# EAGLE schematic sdcard_noBMP (EAGLE 9.6.0)
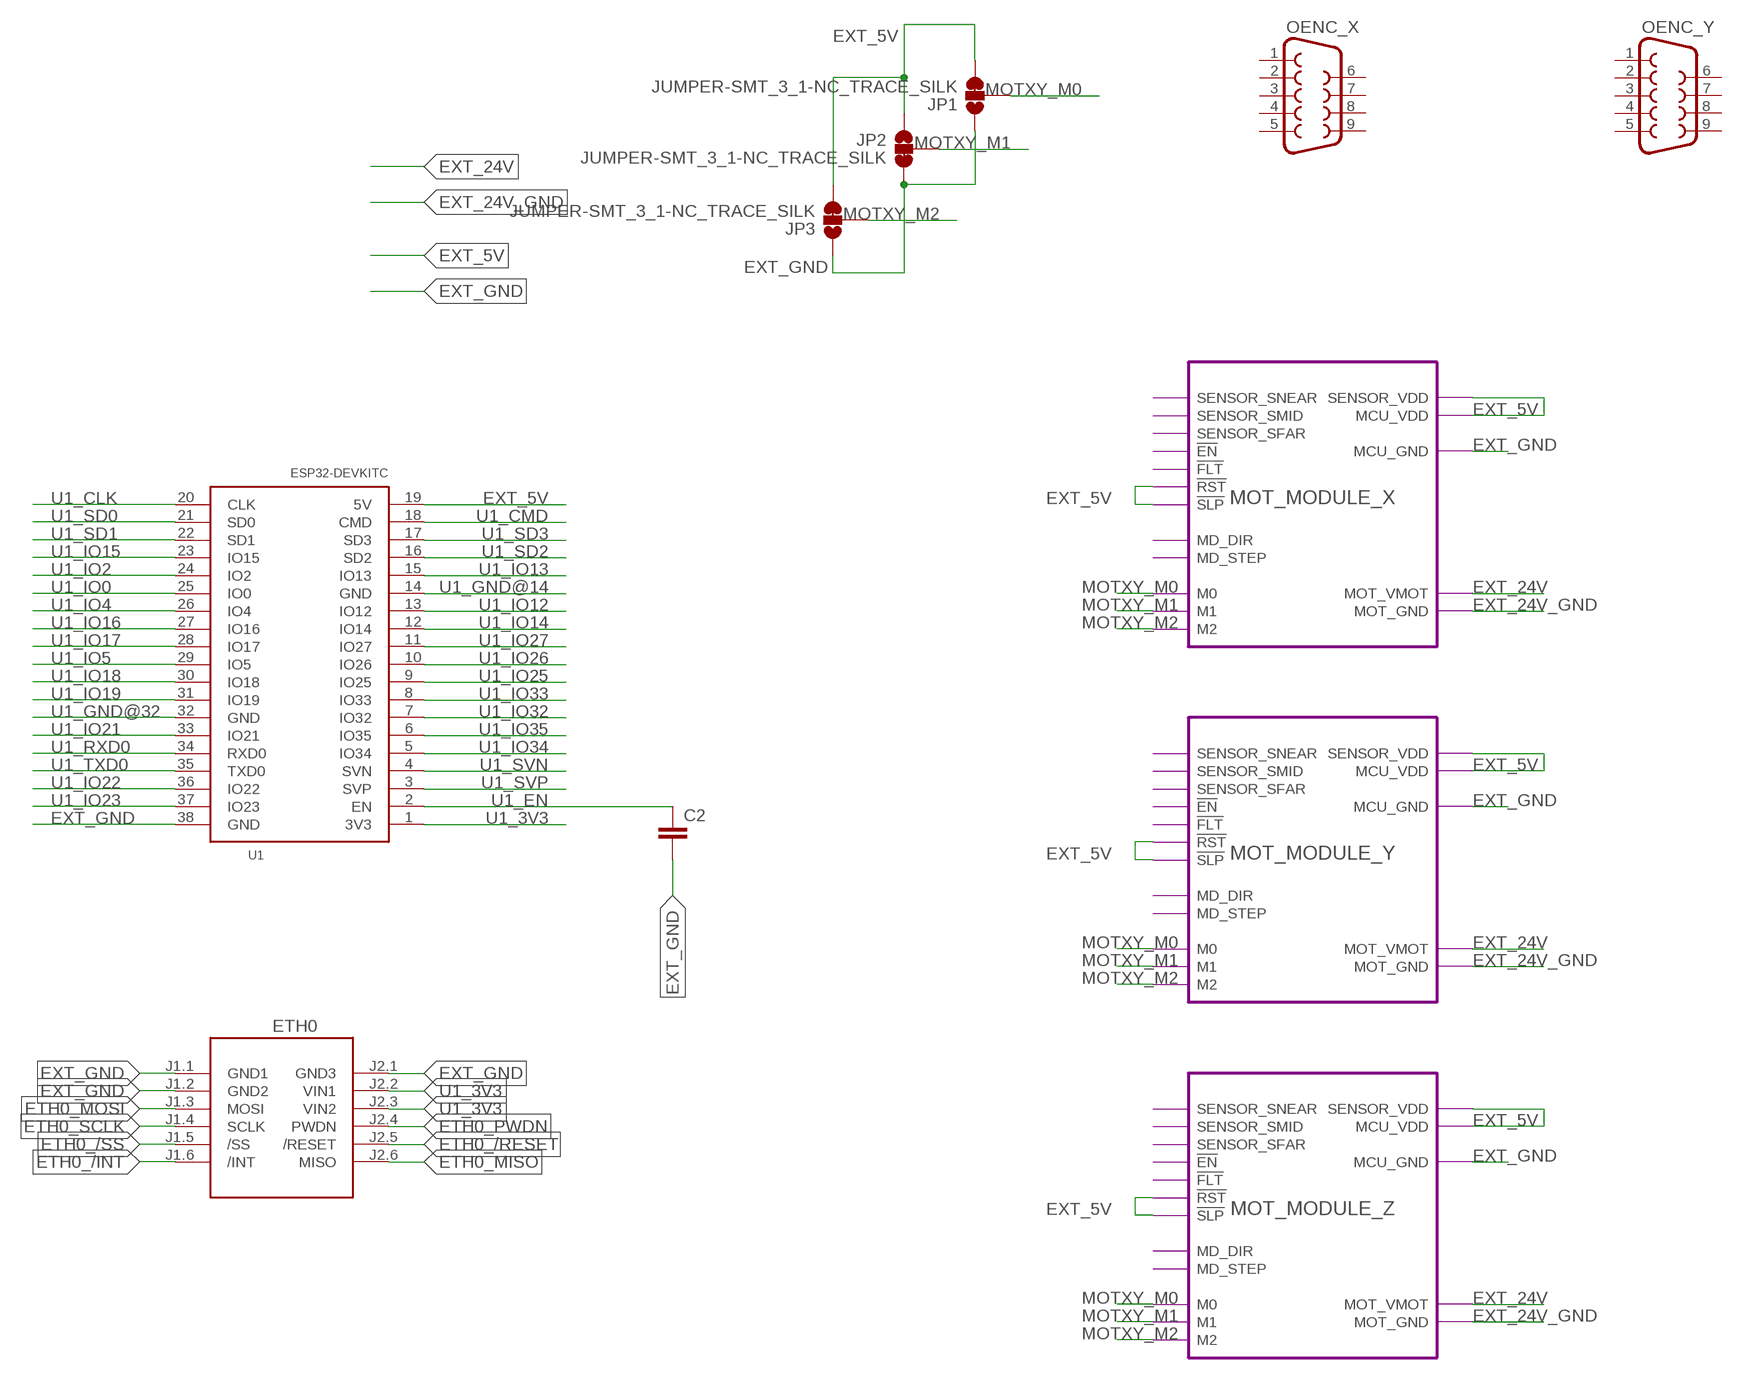
[diagram p0: schematic, sheet 1]

## Parts
C2  C2.5/2  [C2.5-2]
ETH0  WIZ820IO_DEVICE'DUAL-IN-LINE'  [WIZ820IO]
JP1  JUMPER-SMT_3_1-NC_TRACE_SILK  [SMT-JUMPER_3_1-NC_TRACE_SILK]
JP2  JUMPER-SMT_3_1-NC_TRACE_SILK  [SMT-JUMPER_3_1-NC_TRACE_SILK]
JP3  JUMPER-SMT_3_1-NC_TRACE_SILK  [SMT-JUMPER_3_1-NC_TRACE_SILK]
OENC_X  F09VP  [F09VP]
OENC_Y  F09VP  [F09VP]
U1  ESP32DEVKITC  [ESP32-DEVKITC]

## Module instances
MOT_MODULE_X = MOT_MODULE
MOT_MODULE_Y = MOT_MODULE
MOT_MODULE_Z = MOT_MODULE

## Nets
ETH0_/INT: ETH0.J1.6(/INT)
ETH0_/RESET: ETH0.J2.5(/RESET)
ETH0_/SS: ETH0.J1.5(/SS)
ETH0_MISO: ETH0.J2.6(MISO)
ETH0_MOSI: ETH0.J1.3(MOSI)
ETH0_PWDN: ETH0.J2.4(PWDN)
ETH0_SCLK: ETH0.J1.4(SCLK)
EXT_5V: JP1.3 JP2.1 JP3.3 U1.19(5V) ; port MOT_MODULE_X.!RST MOT_MODULE_X.!SLP MOT_MODULE_X.MCU_VDD MOT_MODULE_X.SENSOR_VDD MOT_MODULE_Y.!RST MOT_MODULE_Y.!SLP MOT_MODULE_Y.MCU_VDD MOT_MODULE_Y.SENSOR_VDD MOT_MODULE_Z.!RST MOT_MODULE_Z.!SLP MOT_MODULE_Z.MCU_VDD MOT_MODULE_Z.SENSOR_VDD
EXT_24V: port MOT_MODULE_X.MOT_VMOT MOT_MODULE_Y.MOT_VMOT MOT_MODULE_Z.MOT_VMOT
EXT_24V_GND: port MOT_MODULE_X.MOT_GND MOT_MODULE_Y.MOT_GND MOT_MODULE_Z.MOT_GND
EXT_GND: C2.2 ETH0.J1.1(GND1) ETH0.J1.2(GND2) ETH0.J2.1(GND3) JP1.1 JP2.3 JP3.1 U1.38(GND) ; port MOT_MODULE_X.MCU_GND MOT_MODULE_Y.MCU_GND MOT_MODULE_Z.MCU_GND
MOTXY_M0: JP1.2 ; port MOT_MODULE_X.M0 MOT_MODULE_Y.M0 MOT_MODULE_Z.M0
MOTXY_M1: JP2.2 ; port MOT_MODULE_X.M1 MOT_MODULE_Y.M1 MOT_MODULE_Z.M1
MOTXY_M2: JP3.2 ; port MOT_MODULE_X.M2 MOT_MODULE_Y.M2 MOT_MODULE_Z.M2
U1_3V3: ETH0.J2.2(VIN1) ETH0.J2.3(VIN2) U1.1(3V3)
U1_CLK: U1.20(CLK)
U1_CMD: U1.18(CMD)
U1_EN: C2.1 U1.2(EN)
U1_GND@14: U1.14(GND)
U1_GND@32: U1.32(GND)
U1_IO0: U1.25(IO0)
U1_IO2: U1.24(IO2)
U1_IO4: U1.26(IO4)
U1_IO5: U1.29(IO5)
U1_IO12: U1.13(IO12)
U1_IO13: U1.15(IO13)
U1_IO14: U1.12(IO14)
U1_IO15: U1.23(IO15)
U1_IO16: U1.27(IO16)
U1_IO17: U1.28(IO17)
U1_IO18: U1.30(IO18)
U1_IO19: U1.31(IO19)
U1_IO21: U1.33(IO21)
U1_IO22: U1.36(IO22)
U1_IO23: U1.37(IO23)
U1_IO25: U1.9(IO25)
U1_IO26: U1.10(IO26)
U1_IO27: U1.11(IO27)
U1_IO32: U1.7(IO32)
U1_IO33: U1.8(IO33)
U1_IO34: U1.5(IO34)
U1_IO35: U1.6(IO35)
U1_RXD0: U1.34(RXD0)
U1_SD0: U1.21(SD0)
U1_SD1: U1.22(SD1)
U1_SD2: U1.16(SD2)
U1_SD3: U1.17(SD3)
U1_SVN: U1.4(SVN)
U1_SVP: U1.3(SVP)
U1_TXD0: U1.35(TXD0)
Unconnected: OENC_X.1 OENC_X.2 OENC_X.3 OENC_X.4 OENC_X.5 OENC_X.6 OENC_X.7 OENC_X.8 OENC_X.9 OENC_Y.1 OENC_Y.2 OENC_Y.3 OENC_Y.4 OENC_Y.5 OENC_Y.6 OENC_Y.7 OENC_Y.8 OENC_Y.9

## Library data of the parts
C2 = capacitor-wima:C: CAPACITOR naming: grid - package width
ETH0 = Wiz820io:WIZ820IO_DEVICE: WIZnet, WIZ820io plug in module incl. W5200 chip and MagJack
JP1-JP3 = SparkFun-Jumpers:JUMPER-SMT_3_1-NC_TRACE: Normally closed trace jumper (1 of 2 connections) This jumper has a trace between two pads so it's normally closed (NC). The other connection is normally open (NO). Use a razor knife to open the connection. For best results follow the IPC guidelines for cutting traces: Cutout at least 0.063 mm (0.005 in). Remove all loose material to clean up the cut area. Seal the cut with an approved epoxy. Reapply solder to reclose the connection, or to close the NO connection.
OENC_X OENC_Y = con-subd:F09: SUB-D; OC_FARNELL: unknown; OC_NEWARK: unknown
U1 = ESP32-DEVKITC:ESP32DEVKITC

## Module MOT_MODULE
Ports: MCU_VDD(io) MOT_VMOT(io) SENSOR_VDD(io) MCU_GND(io) MOT_GND(io) SENSOR_SNEAR(out) SENSOR_SMID(out) SENSOR_SFAR(out) !EN(in) !FLT(in) !RST(in) !SLP(in) MD_DIR(in) MD_STEP(in) M0(in) M1(in) M2(in)
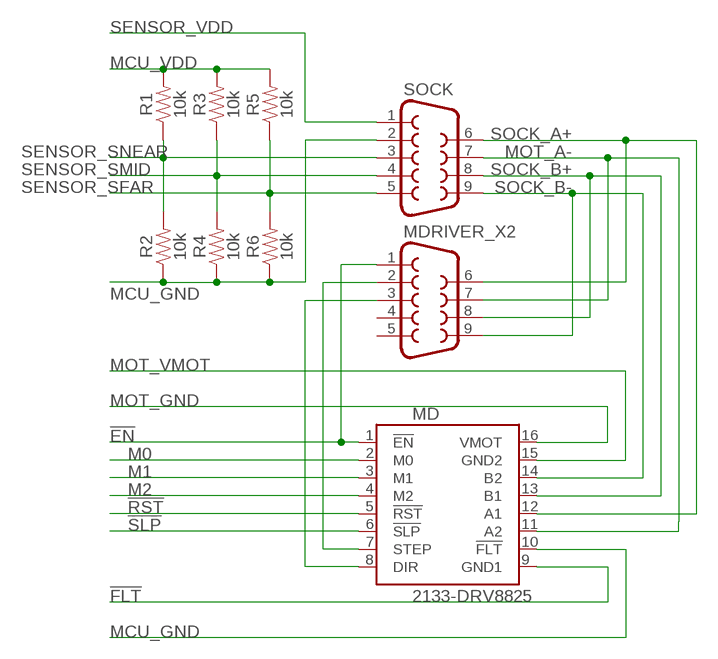
[diagram p1: schematic, module MOT_MODULE, sheet 1]

### Parts
MD  2133-DRV8825  [DRV8825]
MDRIVER_X2  F09VP  [F09VP]
R1  10k  10KOHM-0603-1/10W-1%  [0603]
R2  10k  10KOHM-0603-1/10W-1%  [0603]
R3  10k  10KOHM-0603-1/10W-1%  [0603]
R4  10k  10KOHM-0603-1/10W-1%  [0603]
R5  10k  10KOHM-0603-1/10W-1%  [0603]
R6  10k  10KOHM-0603-1/10W-1%  [0603]
SOCK  F09VP  [F09VP]

### Nets
!EN: MD.1(!EN) MDRIVER_X2.1
!FLT: MD.9(GND1)
!RST: MD.5(!RST)
!SLP: MD.6(!SLP)
M0: MD.2(M0)
M1: MD.3(M1)
M2: MD.4(M2)
MCU_GND: MD.10(!FLT) R2.1 R4.1 R6.1 SOCK.2
MCU_VDD: R1.2 R3.2 R5.2
MD_DIR: MD.8(DIR) MDRIVER_X2.3
MD_STEP: MD.7(STEP) MDRIVER_X2.2
MOT_A-: MD.11(A2) MDRIVER_X2.7 SOCK.7
MOT_GND: MD.16(VMOT)
MOT_VMOT: MD.15(GND2)
SENSOR_SFAR: R5.1 R6.2 SOCK.5
SENSOR_SMID: R3.1 R4.2 SOCK.4
SENSOR_SNEAR: R1.1 R2.2 SOCK.3
SENSOR_VDD: SOCK.1
SOCK_A+: MD.12(A1) MDRIVER_X2.6 SOCK.6
SOCK_B+: MD.13(B1) MDRIVER_X2.8 SOCK.8
SOCK_B-: MD.14(B2) MDRIVER_X2.9 SOCK.9
Unconnected: MDRIVER_X2.4 MDRIVER_X2.5

### Library data of the parts
MD = pololu-stepper-driver:2133-DRV8825: DRV8825 Stepper Motor Driver Carrier, High Current #2133 DRV8825 Stepper Motor Driver Carrier; High Current <https://www.pololu.com/product/2133> in Japan, Suzaku Lab. Ltd. <https://suzakugiken.jp/> #2133 DRV8825 大電流用ステッピングモータドライバ <https://szc.jp/po2133>
MDRIVER_X2 SOCK = con-subd:F09: SUB-D; OC_FARNELL: unknown; OC_NEWARK: unknown
R1-R6 = SparkFun-Resistors:10KOHM: 10kΩ resistor A resistor is a passive two-terminal electrical component that implements electrical resistance as a circuit element. Resistors act to reduce current flow, and, at the same time, act to lower voltage levels within circuits. - Wikipedia; PROD_ID: RES-00824

## Module MOT_MODULE_MIN
Ports: 

### Library data of the parts